# Altium schematic sheet BMD_RevB_B4_FPGA2.SchDoc: FPGA2
size 401 x 291 mm; DocumentNumber: 2; SheetNumber: 4; SheetTotal: 6
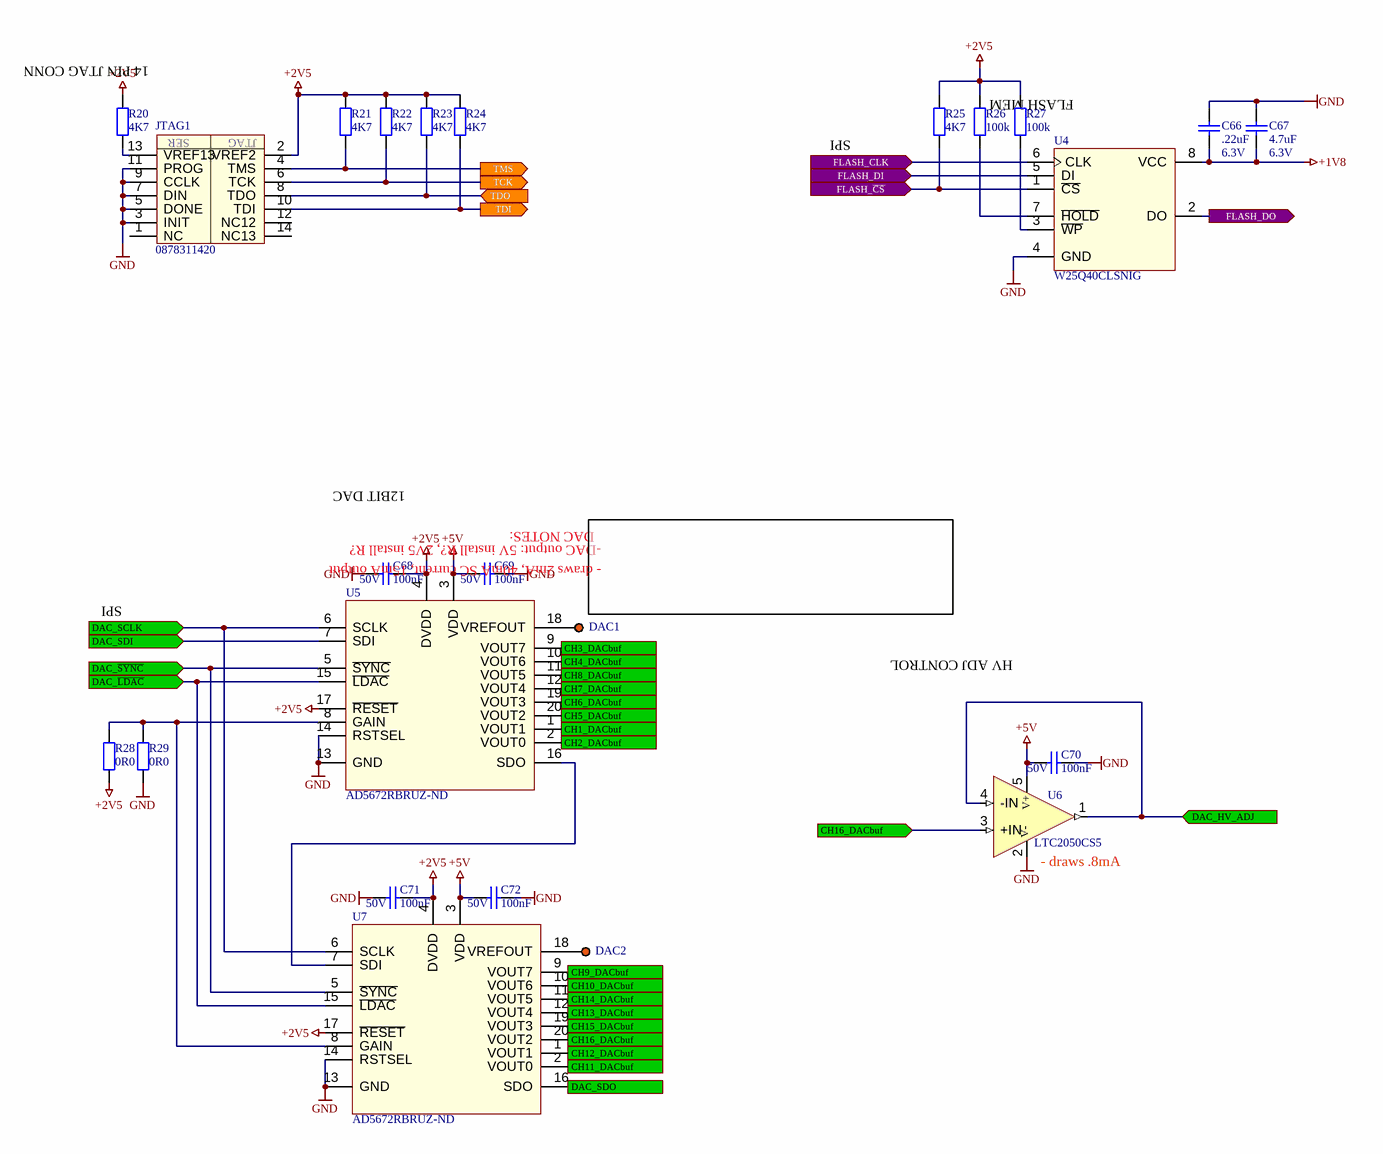
[diagram p0: BMD_RevB_B4_FPGA2.SchDoc]

## Parts
C66  .22uF  Voltage rating: 6.3V  [CC0402N1R]
C67  4.7uF  Voltage rating: 6.3V  [CC0402N1R]
C68  100nF  Voltage rating: 50V  [CC0402N1R]
C69  100nF  Voltage rating: 50V  [CC0402N1R]
C70  100nF  Voltage rating: 50V  [CC0402N1R]
C71  100nF  Voltage rating: 50V  [CC0402N1R]
C72  100nF  Voltage rating: 50V  [CC0402N1R]
DAC1  SP1.5S  [SP1.5SQ]  (value not drawn)  (no BOM)
DAC2  SP1.5S  [SP1.5SQ]  (value not drawn)  (no BOM)
JTAG1  0878311420  [JTAG_14PIN_2MM_VERT]
R20  4K7  [RC0402N1R]
R21  4K7  [RC0402N1R]
R22  4K7  [RC0402N1R]
R23  4K7  [RC0402N1R]
R24  4K7  [RC0402N1R]
R25  4K7  [RC0402N1R]
R26  100k  [RC0603N1R]
R27  100k  [RC0603N1R]
R28  0R0  [RC0603N1R]
R29  0R0  [RC0603N1R]
U4  W25Q40CLSNIG  [SOIC_8PIN]
U5  AD5672RBRUZ-ND  [TSSOP_20PIN]
U6  LTC2050CS5  [SOT23-5]
U7  AD5672RBRUZ-ND  [TSSOP_20PIN]

## Ports
CH1_DACbuf (out), CH2_DACbuf (out), CH3_DACbuf (out), CH4_DACbuf (out), CH5_DACbuf (out), CH6_DACbuf (out), CH7_DACbuf (out), CH8_DACbuf (out), CH9_DACbuf (out), CH10_DACbuf (out), CH11_DACbuf (out), CH12_DACbuf (out), CH13_DACbuf (out), CH14_DACbuf (out), CH15_DACbuf (out), CH16_DACbuf (in), CH16_DACbuf (out), DAC_HV_ADJ (in), DAC_SCLK (in), DAC_SDI (in), DAC_SDO (out), DAC_~{LDAC} (in), DAC_~{SYNC} (in), FLASH_CLK (in), FLASH_DI (in), FLASH_DO (out), FLASH_~{CS} (in), TCK (out), TDI (out), TDO (in), TMS (out)

## Nets
+1V8: C66.1 C67.1 U4.8(VCC)
+2V5: C68.1 C71.1 JTAG1.2(VREF2) R20.2 R21.2 R22.2 R23.2 R24.2 R25.2 R26.2 R27.2 R28.2 U5.4(DVDD) U5.17(~{RESET}) U7.4(DVDD) U7.17(~{RESET})
+5V: C69.2 C70.2 C72.2 U5.3(VDD) U6.5(V+) U7.3(VDD)
GND: C66.2 C67.2 C68.2 C69.1 C70.1 C71.2 C72.1 JTAG1.3(INIT) JTAG1.5(DONE) JTAG1.7(DIN) JTAG1.9(CCLK) JTAG1.11(PROG) R29.2 U4.4(GND) U5.13(GND) U5.14(RSTSEL) U6.2(V-) U7.13(GND) U7.14(RSTSEL)
CH1_DACbuf: U5.1(VOUT1) ; port CH1_DACbuf
CH2_DACbuf: U5.2(VOUT0) ; port CH2_DACbuf
CH3_DACbuf: U5.9(VOUT7) ; port CH3_DACbuf
CH4_DACbuf: U5.10(VOUT6) ; port CH4_DACbuf
CH5_DACbuf: U5.20(VOUT2) ; port CH5_DACbuf
CH6_DACbuf: U5.19(VOUT3) ; port CH6_DACbuf
CH7_DACbuf: U5.12(VOUT4) ; port CH7_DACbuf
CH8_DACbuf: U5.11(VOUT5) ; port CH8_DACbuf
CH9_DACbuf: U7.9(VOUT7) ; port CH9_DACbuf
CH10_DACbuf: U7.10(VOUT6) ; port CH10_DACbuf
CH11_DACbuf: U7.2(VOUT0) ; port CH11_DACbuf
CH12_DACbuf: U7.1(VOUT1) ; port CH12_DACbuf
CH13_DACbuf: U7.12(VOUT4) ; port CH13_DACbuf
CH14_DACbuf: U7.11(VOUT5) ; port CH14_DACbuf
CH15_DACbuf: U7.19(VOUT3) ; port CH15_DACbuf
CH16_DACbuf: U6.3(+IN) U7.20(VOUT2) ; port CH16_DACbuf
DAC_HV_ADJ: U6.1(OUT) U6.4(-IN) ; port DAC_HV_ADJ
DAC_~{LDAC}: U5.15(~{LDAC}) U7.15(~{LDAC}) ; port DAC_~{LDAC}
DAC_~{SYNC}: U5.5(~{SYNC}) U7.5(~{SYNC}) ; port DAC_~{SYNC}
DAC_SCLK: U5.6(SCLK) U7.6(SCLK) ; port DAC_SCLK
DAC_SDI: U5.7(SDI) ; port DAC_SDI
DAC_SDO: U7.16(SDO) ; port DAC_SDO
FLASH_~{CS}: R25.1 U4.1(~{CS}) ; port FLASH_~{CS}
FLASH_CLK: U4.6(CLK) ; port FLASH_CLK
FLASH_DI: U4.5(DI) ; port FLASH_DI
FLASH_DO: U4.2(DO) ; port FLASH_DO
TCK: JTAG1.6(TCK) R22.1 ; port TCK
TDI: JTAG1.10(TDI) R24.1 ; port TDI
TDO: JTAG1.8(TDO) R23.1 ; port TDO
TMS: JTAG1.4(TMS) R21.1 ; port TMS
NetDAC1_1: DAC1.1 U5.18(VREFOUT)
NetDAC2_1: DAC2.1 U7.18(VREFOUT)
NetJTAG1_13: JTAG1.13(VREF13) R20.1
NetR26_1: R26.1 U4.7(~{HOLD})
NetR27_1: R27.1 U4.3(~{WP})
NetR28_1: R28.1 R29.1 U5.8(GAIN) U7.8(GAIN)
NetU5_16: U5.16(SDO) U7.7(SDI)

Not connected (* = marked no-connect by the designer): JTAG1 1(NC) 12(NC12) 14(NC13)

## Notes on the sheet
- (near R20) 14 PIN JTAG CONN
- FLASH MEM
- SPI
- 12BIT DAC
- DAC NOTES:
- -DAC output: 5V install R?, 2V5 install R?
- - draws 2mA, 40mA SC current, 15mA output
- HV ADJ CONTROL
- (near U6) - draws .8mA
- Board:
- High Energy Physics Group, Instrumentation Development Lab
- Drawn By:
- Designer:
- Approved By:
- Revision:
- IDLAB design #:
- Variant:
- Sheet Title:
- Modif. Date:
- Sheet       of
- (in symbol 14PIN JTAG) SER; JTAG

## Library data of the parts
C66 = CAPCC0402_.22uF_6.3V: .22µF ±10% 6.3V X7R Ceramic Capacitor; Manufacturer: Samsung Electro-Mechanics America, Inc.; Manufacturer No: CL05A224KQ5NNNC; Tech: SMDR; Package: Cap Chip 0402; Supplier 1: Digi-Key; Supplier Part Number 1: 1276-1124-1-ND
C67 = CAPCC0402_4.7uF_6.3V: 4.7µF ±10% 6.3V X7R Ceramic Capacitor; Manufacturer: Samsung Electro-Mechanics America, Inc.; Manufacturer No: CL05A475KQ5NRNC; Tech: SMDR; Package: Cap Chip 0402; Supplier 1: Digi-Key; Supplier Part Number 1: 1276-1481-1-ND
C68-C72 = CAPCC0402_100N_50VX7R: 0.10µF 50V Ceramic Capacitor X7R 0402; Manufacturer: TDK; Manufacturer No: C1005X7R1H104K050BB; Tech: SMDR; Package: Cap Chip 0402; Supplier 1: Digi-Key; Supplier Part Number 1: 445-5932-1-ND
DAC1 DAC2 = SP1.5S: Wire solder pin 1.5mm; Sort: 610; Tech: THDW; Price: 0
JTAG1 = 14PIN JTAG: 14 Positions Header, Shrouded Connector 0.079" (2.00mm) Through Hole Gold; Manufacturer: Molex, LLC; Tech: SMDR; Manufacturer No: 0878311420; Supplier 1: Digi-Key; Supplier Part Number 1: WM17469-ND
R20-R25 = RES0402-4.7K-1%100PPM: RES SMD 4.7K OHM 1% 1/10W 0402; Manufacturer: Panasonic; Manufacturer No: ERJ-2RKF4701X; Tech: SMDR; Package: Res Chip 0402; Supplier 1: Digi-Key; Supplier Part Number 1: P4.70KLCT-ND
R26 R27 = PR_RES0603-1_100k-0.1%25PPM: Chip Resistor 0603 100mW 0.1% 25ppm; Manufacturer: Panasonic; Manufacturer No: ERA-3AEB104V; Tech: SMDR; Package: Res Chip 0603; Supplier 1: Digi-Key; Supplier Part Number 1: P100KDBCT-ND; Supplier 2: Newark; Supplier Part Number 2: 08N2096; Supplier 3: Mouser; Supplier Part Number 3: 667-ERA-3AEB104V
R28 R29 = RES0603-0R0-1%100PPM: RES SMD 0.0OHM JUMPER 1/10W 0603; Manufacturer: Panasonic; Manufacturer No: ERJ-3GEY0R00V; Tech: SMDR; Package: Res Chip 0603; Supplier 1: Digi-Key; Supplier Part Number 1: P0.0GCT-ND
U4 = Flash memory 4Mbit: IC FLASH 4MBIT 50MHZ 8SOIC; Manufacturer: Winbond Electronics; Tech: Surface Mount; Manufacturer No: W25Q40CLSNIG; Supplier 1: Digi-Key; Supplier Part Number 1: W25Q40CLSNIG-ND
U5 U7 = DAC_12bit_8ch: IC DAC 12BIT 16CHAN 3V 52LQFP; Manufacturer: Analog Devices Inc.; Tech: Surface Mount; Manufacturer No: AD5672RBRUZ-ND; Supplier 1: Digi-Key; Supplier Part Number 1: AD5672RBRUZ-ND
U6 = OPAMP_LTC2050CS5: Zero-Drift Operational Amplifier; Manufacturer: Linear Technology; Manufacturer No: LTC2050CS5#TRMPBF; Tech: SMDR; Package: SOT23-5; Supplier 1: Digi-Key; Supplier Part Number 1: LTC2050CS5#TRMPBFCT-ND